# EAGLE schematic picotouch_smd (EAGLE 9.6.2)
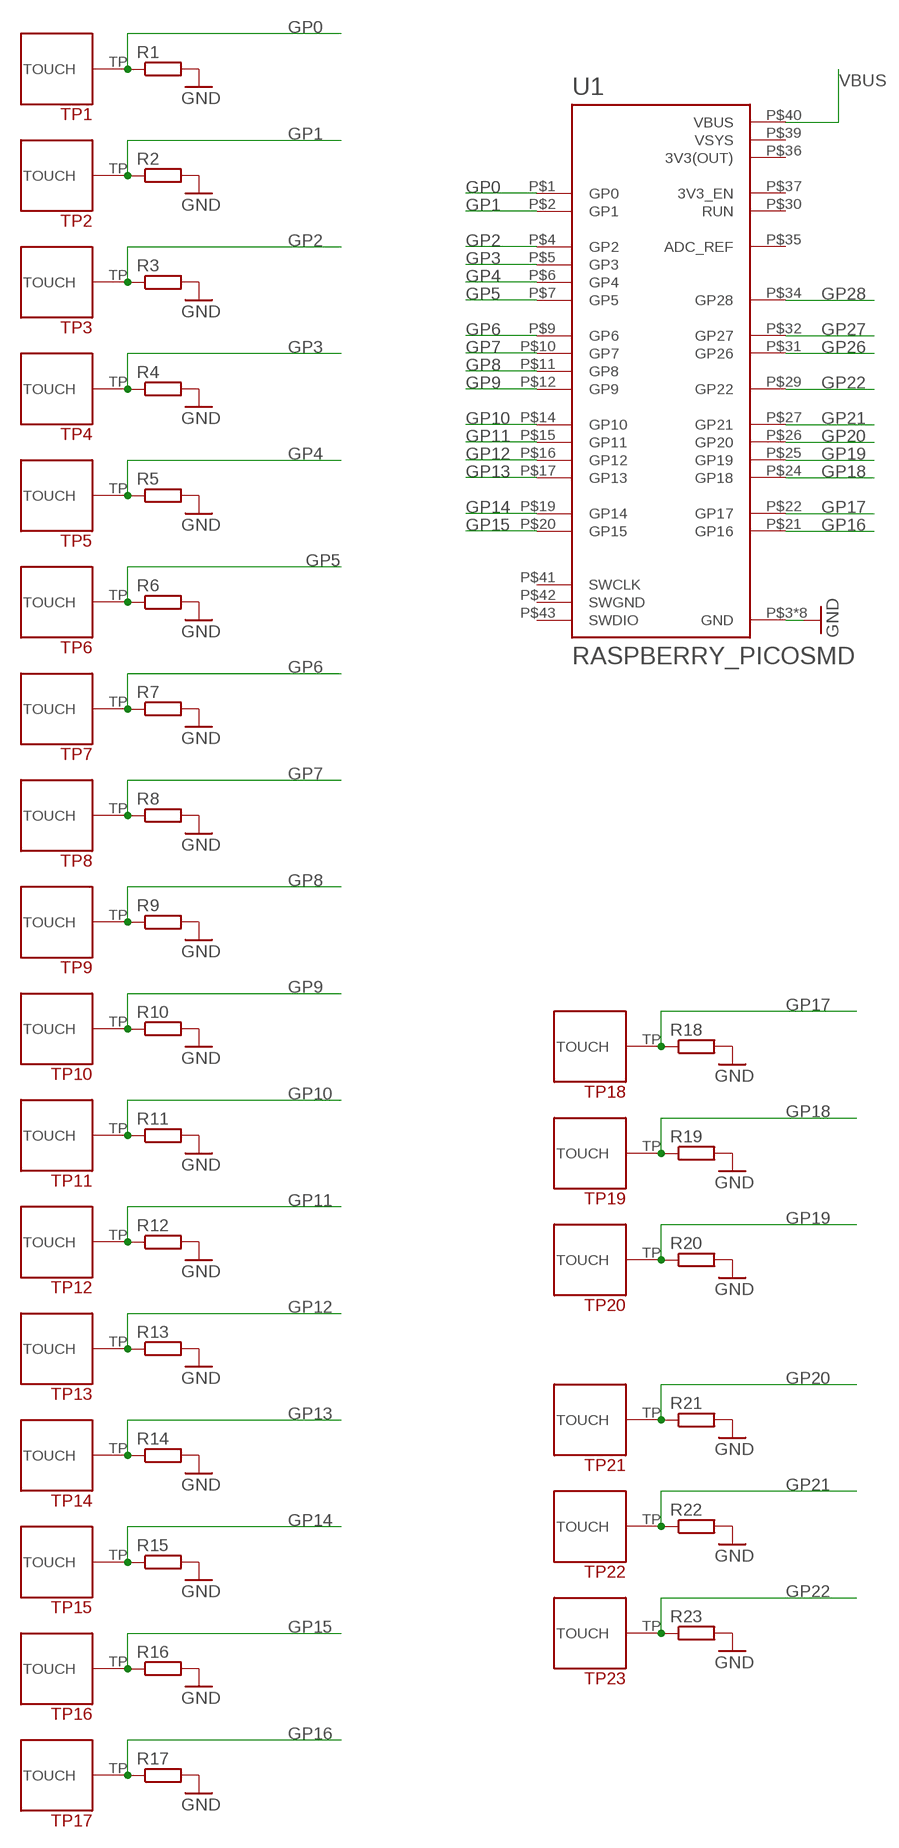
[diagram p0: schematic, sheet 1]

## Parts
R1  R-EU_R0805  [R0805]
R2  R-EU_R0805  [R0805]
R3  R-EU_R0805  [R0805]
R4  R-EU_R0805  [R0805]
R5  R-EU_R0805  [R0805]
R6  R-EU_R0805  [R0805]
R7  R-EU_R0805  [R0805]
R8  R-EU_R0805  [R0805]
R9  R-EU_R0805  [R0805]
R10  R-EU_R0805  [R0805]
R11  R-EU_R0805  [R0805]
R12  R-EU_R0805  [R0805]
R13  R-EU_R0805  [R0805]
R14  R-EU_R0805  [R0805]
R15  R-EU_R0805  [R0805]
R16  R-EU_R0805  [R0805]
R17  R-EU_R0805  [R0805]
R18  R-EU_R0805  [R0805]
R19  R-EU_R0805  [R0805]
R20  R-EU_R0805  [R0805]
R21  R-EU_R0805  [R0805]
R22  R-EU_R0805  [R0805]
R23  R-EU_R0805  [R0805]
TP1  TOUCHPADA  [TOUCHPADA]
TP2  TOUCHPADA  [TOUCHPADA]
TP3  TOUCHPADA  [TOUCHPADA]
TP4  TOUCHPADA  [TOUCHPADA]
TP5  TOUCHPADA  [TOUCHPADA]
TP6  TOUCHPADA  [TOUCHPADA]
TP7  TOUCHPADA  [TOUCHPADA]
TP8  TOUCHPADA  [TOUCHPADA]
TP9  TOUCHPADA  [TOUCHPADA]
TP10  TOUCHPADA  [TOUCHPADA]
TP11  TOUCHPADA  [TOUCHPADA]
TP12  TOUCHPADA  [TOUCHPADA]
TP13  TOUCHPADA  [TOUCHPADA]
TP14  TOUCHPADA  [TOUCHPADA]
TP15  TOUCHPADA  [TOUCHPADA]
TP16  TOUCHPADA  [TOUCHPADA]
TP17  TOUCHPADA  [TOUCHPADA]
TP18  TOUCHPADB  [TOUCHPADB]
TP19  TOUCHPADB  [TOUCHPADB]
TP20  TOUCHPADB  [TOUCHPADB]
TP21  TOUCHPADB  [TOUCHPADB]
TP22  TOUCHPADB  [TOUCHPADB]
TP23  TOUCHPADB  [TOUCHPADB]
U1  RASPBERRY_PICOSMD  [PICO-PKG-SMD]

## Nets
GND: R1.2 R2.2 R3.2 R4.2 R5.2 R6.2 R7.2 R8.2 R9.2 R10.2 R11.2 R12.2 R13.2 R14.2 R15.2 R16.2 R17.2 R18.2 R19.2 R20.2 R21.2 R22.2 R23.2 U1.P$3(GND) U1.P$8(GND) U1.P$13(GND) U1.P$18(GND) U1.P$23(GND) U1.P$28(GND) U1.P$33(GND) U1.P$38(GND)
GP0: R1.1 TP1.TP(TOUCH) U1.P$1(GP0)
GP1: R2.1 TP2.TP(TOUCH) U1.P$2(GP1)
GP2: R3.1 TP3.TP(TOUCH) U1.P$4(GP2)
GP3: R4.1 TP4.TP(TOUCH) U1.P$5(GP3)
GP4: R5.1 TP5.TP(TOUCH) U1.P$6(GP4)
GP5: R6.1 TP6.TP(TOUCH) U1.P$7(GP5)
GP6: R7.1 TP7.TP(TOUCH) U1.P$9(GP6)
GP7: R8.1 TP8.TP(TOUCH) U1.P$10(GP7)
GP8: R9.1 TP9.TP(TOUCH) U1.P$11(GP8)
GP9: R10.1 TP10.TP(TOUCH) U1.P$12(GP9)
GP10: R11.1 TP11.TP(TOUCH) U1.P$14(GP10)
GP11: R12.1 TP12.TP(TOUCH) U1.P$15(GP11)
GP12: R13.1 TP13.TP(TOUCH) U1.P$16(GP12)
GP13: R14.1 TP14.TP(TOUCH) U1.P$17(GP13)
GP14: R15.1 TP15.TP(TOUCH) U1.P$19(GP14)
GP15: R16.1 TP16.TP(TOUCH) U1.P$20(GP15)
GP16: R17.1 TP17.TP(TOUCH) U1.P$21(GP16)
GP17: R18.1 TP18.TP(TOUCH) U1.P$22(GP17)
GP18: R19.1 TP19.TP(TOUCH) U1.P$24(GP18)
GP19: R20.1 TP20.TP(TOUCH) U1.P$25(GP19)
GP20: R21.1 TP21.TP(TOUCH) U1.P$26(GP20)
GP21: R22.1 TP22.TP(TOUCH) U1.P$27(GP21)
GP22: R23.1 TP23.TP(TOUCH) U1.P$29(GP22)
GP26: U1.P$31(GP26)
GP27: U1.P$32(GP27)
GP28: U1.P$34(GP28)
VBUS: U1.P$40(VBUS)
Unconnected: U1.P$30(RUN) U1.P$35(ADC_REF) U1.P$37(3V3_EN) U1.P$41(SWCLK) U1.P$43(SWDIO)

## Power pins joined to a net without a drawn wire
3V3(OUT): U1.P$36(3V3(OUT))
SWGND: U1.P$42(SWGND)
VSYS: U1.P$39(VSYS)

## Library data of the parts
R1-R23 = rcl:R-EU_: RESISTOR, European symbol; SPICEPREFIX: R
TP1-TP23 = todstuff:TOUCHPAD
U1 = RpiPico:RASPBERRY_PICO: Raspberry Pi Pico